# Altium schematic sheet Ethernet1.SchDoc
size A4; DocumentNumber: 20; SheetNumber: 20; SheetTotal: 47
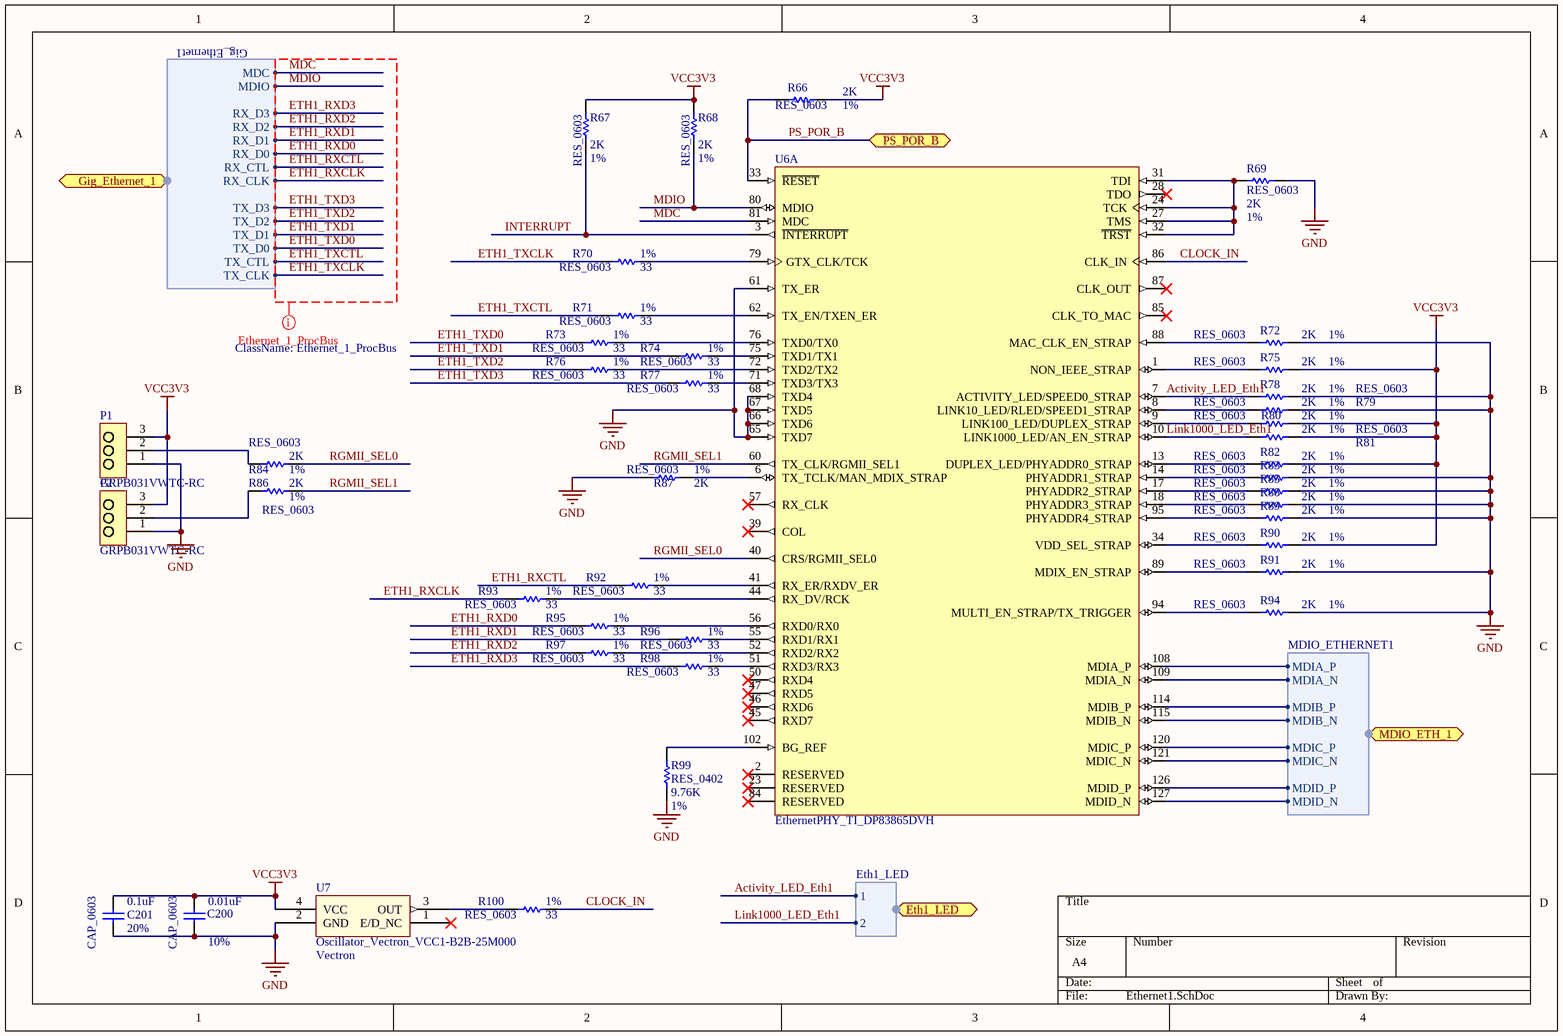
[diagram p0: Ethernet1.SchDoc]

## Parts
C200  CAP_0603  value 0.01uF  Tolerance: 10%  [CAPC0603(1608)100_N]
C201  CAP_0603  value 0.1uF  Tolerance: 20%  [CAPC0603(1608)100_N]
P1  GRPB031VWTC-RC  [Header_3-Pos_Sullins_GRPB031VWTC-RC]
P2  GRPB031VWTC-RC  [Header_3-Pos_Sullins_GRPB031VWTC-RC]
R66  RES_0603  value 2K  Tolerance: 1%  [RESC0603(1608)_N]
R67  RES_0603  value 2K  Tolerance: 1%  [RESC0603(1608)_N]
R68  RES_0603  value 2K  Tolerance: 1%  [RESC0603(1608)_N]
R69  RES_0603  value 2K  Tolerance: 1%  [RESC0603(1608)_N]
R70  RES_0603  value 33  Tolerance: 1%  [RESC0603(1608)_N]
R71  RES_0603  value 33  Tolerance: 1%  [RESC0603(1608)_N]
R72  RES_0603  value 2K  Tolerance: 1%  [RESC0603(1608)_N]
R73  RES_0603  value 33  Tolerance: 1%  [RESC0603(1608)_N]
R74  RES_0603  value 33  Tolerance: 1%  [RESC0603(1608)_N]
R75  RES_0603  value 2K  Tolerance: 1%  [RESC0603(1608)_N]
R76  RES_0603  value 33  Tolerance: 1%  [RESC0603(1608)_N]
R77  RES_0603  value 33  Tolerance: 1%  [RESC0603(1608)_N]
R78  RES_0603  value 2K  Tolerance: 1%  [RESC0603(1608)_N]
R79  RES_0603  value 2K  Tolerance: 1%  [RESC0603(1608)_N]
R80  RES_0603  value 2K  Tolerance: 1%  [RESC0603(1608)_N]
R81  RES_0603  value 2K  Tolerance: 1%  [RESC0603(1608)_N]
R82  RES_0603  value 2K  Tolerance: 1%  [RESC0603(1608)_N]
R83  RES_0603  value 2K  Tolerance: 1%  [RESC0603(1608)_N]
R84  RES_0603  value 2K  Tolerance: 1%  [RESC0603(1608)_N]
R85  RES_0603  value 2K  Tolerance: 1%  [RESC0603(1608)_N]
R86  RES_0603  value 2K  Tolerance: 1%  [RESC0603(1608)_N]
R87  RES_0603  value 2K  Tolerance: 1%  [RESC0603(1608)_N]
R88  RES_0603  value 2K  Tolerance: 1%  [RESC0603(1608)_N]
R89  RES_0603  value 2K  Tolerance: 1%  [RESC0603(1608)_N]
R90  RES_0603  value 2K  Tolerance: 1%  [RESC0603(1608)_N]
R91  RES_0603  value 2K  Tolerance: 1%  [RESC0603(1608)_N]
R92  RES_0603  value 33  Tolerance: 1%  [RESC0603(1608)_N]
R93  RES_0603  value 33  Tolerance: 1%  [RESC0603(1608)_N]
R94  RES_0603  value 2K  Tolerance: 1%  [RESC0603(1608)_N]
R95  RES_0603  value 33  Tolerance: 1%  [RESC0603(1608)_N]
R96  RES_0603  value 33  Tolerance: 1%  [RESC0603(1608)_N]
R97  RES_0603  value 33  Tolerance: 1%  [RESC0603(1608)_N]
R98  RES_0603  value 33  Tolerance: 1%  [RESC0603(1608)_N]
R99  RES_0402  value 9.76K  Tolerance: 1%  [RESC0402(1005)_N]
R100  RES_0603  value 33  Tolerance: 1%  [RESC0603(1608)_N]
U6  EthernetPHY_TI_DP83865DVH  [EthernetPHY_TI_DP83865(PQFP)_VLA128A_N]  (part A of 2)
U7  Oscillator_Vectron_VCC1-B2B-25M000  Manufacturer: Vectron  [Oscillator_Vectron_VCC1-B2B-25M000_SMD]

## Ports
Eth1_LED (harness Eth1_LED), Gig_Ethernet_1 (harness Gig_Ethernet1), MDIO_ETH_1 (harness MDIO_ETHERNET1), PS_POR_B (bidir)

## Harnesses
Gig_Ethernet1: TX_CLK, TX_CTL, TX_D0, TX_D1, TX_D2, TX_D3, RX_D0, RX_D1, RX_D2, RX_D3, RX_CLK, RX_CTL, MDIO, MDC
MDIO_ETHERNET1: MDIA_P, MDIA_N, MDIB_P, MDIB_N, MDIC_P, MDIC_N, MDID_P, MDID_N
Eth1_LED: 1, 2

## Nets
GND: C200.1 C201.2 P1.1 P2.1 R69.1 R72.1 R78.1 R79.1 R83.1 R85.1 R87.2 R88.1 R89.1 R91.1 R94.1 R99.1 U6.61(TX_ER) U6.65(TXD7) U6.66(TXD6) U6.67(TXD5) U6.68(TXD4) U7.2(GND)
VCC3V3: C200.2 C201.1 P1.3 P2.3 R66.1 R67.2 R68.2 R75.1 R80.1 R81.1 R82.1 R90.1 U7.4(VCC)
Activity_LED_Eth1: R78.2 U6.7(ACTIVITY_LED/SPEED0_STRAP) ; port Eth1_LED.1
CLOCK_IN: R100.2 U6.86(CLK_IN)
ETH1_RXCLK: R93.1 ; port Gig_Ethernet_1.RX_CLK
ETH1_RXCTL: R92.1 ; port Gig_Ethernet_1.RX_CTL
ETH1_RXD0: R95.1 ; port Gig_Ethernet_1.RX_D0
ETH1_RXD1: R96.1 ; port Gig_Ethernet_1.RX_D1
ETH1_RXD2: R97.1 ; port Gig_Ethernet_1.RX_D2
ETH1_RXD3: R98.1 ; port Gig_Ethernet_1.RX_D3
ETH1_TXCLK: R70.1 ; port Gig_Ethernet_1.TX_CLK
ETH1_TXCTL: R71.1 ; port Gig_Ethernet_1.TX_CTL
ETH1_TXD0: R73.1 ; port Gig_Ethernet_1.TX_D0
ETH1_TXD1: R74.1 ; port Gig_Ethernet_1.TX_D1
ETH1_TXD2: R76.1 ; port Gig_Ethernet_1.TX_D2
ETH1_TXD3: R77.1 ; port Gig_Ethernet_1.TX_D3
INTERRUPT: R67.1 U6.3(~{INTERRUPT})
Link1000_LED_Eth1: R81.2 U6.10(LINK1000_LED/AN_EN_STRAP) ; port Eth1_LED.2
MDC: U6.81(MDC) ; port Gig_Ethernet_1.MDC
MDIO: R68.1 U6.80(MDIO) ; port Gig_Ethernet_1.MDIO
PS_POR_B: R66.2 U6.33(~{RESET}) ; port PS_POR_B
RGMII_SEL0: R84.1 U6.40(CRS/RGMII_SEL0)
RGMII_SEL1: R86.1 U6.60(TX_CLK/RGMII_SEL1)
NetP1_2: P1.2 R84.2
NetP2_2: P2.2 R86.2
NetR69_2: R69.2 U6.24(TCK) U6.27(TMS) U6.31(TDI) U6.32(~{TRST})
NetR70_2: R70.2 U6.79(GTX_CLK/TCK)
NetR71_2: R71.2 U6.62(TX_EN/TXEN_ER)
NetR72_2: R72.2 U6.88(MAC_CLK_EN_STRAP)
NetR73_2: R73.2 U6.76(TXD0/TX0)
NetR74_2: R74.2 U6.75(TXD1/TX1)
NetR75_2: R75.2 U6.1(NON_IEEE_STRAP)
NetR76_2: R76.2 U6.72(TXD2/TX2)
NetR77_2: R77.2 U6.71(TXD3/TX3)
NetR79_2: R79.2 U6.8(LINK10_LED/RLED/SPEED1_STRAP)
NetR80_2: R80.2 U6.9(LINK100_LED/DUPLEX_STRAP)
NetR82_2: R82.2 U6.13(DUPLEX_LED/PHYADDR0_STRAP)
NetR83_2: R83.2 U6.14(PHYADDR1_STRAP)
NetR85_2: R85.2 U6.17(PHYADDR2_STRAP)
NetR87_1: R87.1 U6.6(TX_TCLK/MAN_MDIX_STRAP)
NetR88_2: R88.2 U6.18(PHYADDR3_STRAP)
NetR89_2: R89.2 U6.95(PHYADDR4_STRAP)
NetR90_2: R90.2 U6.34(VDD_SEL_STRAP)
NetR91_2: R91.2 U6.89(MDIX_EN_STRAP)
NetR92_2: R92.2 U6.41(RX_ER/RXDV_ER)
NetR93_2: R93.2 U6.44(RX_DV/RCK)
NetR94_2: R94.2 U6.94(MULTI_EN_STRAP/TX_TRIGGER)
NetR95_2: R95.2 U6.56(RXD0/RX0)
NetR96_2: R96.2 U6.55(RXD1/RX1)
NetR97_2: R97.2 U6.52(RXD2/RX2)
NetR98_2: R98.2 U6.51(RXD3/RX3)
NetR99_2: R99.2 U6.102(BG_REF)
NetR100_1: R100.1 U7.3(OUT)
NetU6_108: U6.108(MDIA_P) ; port MDIO_ETH_1.MDIA_P
NetU6_109: U6.109(MDIA_N) ; port MDIO_ETH_1.MDIA_N
NetU6_114: U6.114(MDIB_P) ; port MDIO_ETH_1.MDIB_P
NetU6_115: U6.115(MDIB_N) ; port MDIO_ETH_1.MDIB_N
NetU6_120: U6.120(MDIC_P) ; port MDIO_ETH_1.MDIC_P
NetU6_121: U6.121(MDIC_N) ; port MDIO_ETH_1.MDIC_N
NetU6_126: U6.126(MDID_P) ; port MDIO_ETH_1.MDID_P
NetU6_127: U6.127(MDID_N) ; port MDIO_ETH_1.MDID_N

Not connected (* = marked no-connect by the designer): U6 2(RESERVED)* 23(RESERVED)* 28(TDO)* 39(COL)* 45(RXD7)* 46(RXD6)* 47(RXD5)* 50(RXD4)* 57(RX_CLK)* 84(RESERVED)* 85(CLK_TO_MAC)* 87(CLK_OUT)*; U7 1(E/D_NC)*

## Layout directives
net class Ethernet_1_ProcBus: ETH1_RXCLK, ETH1_RXCTL, ETH1_RXD0, ETH1_RXD1, ETH1_RXD2, ETH1_RXD3, ETH1_TXCLK, ETH1_TXCTL, ETH1_TXD0, ETH1_TXD1, ETH1_TXD2, ETH1_TXD3, MDC, MDIO

## Library data of the parts
C200 = C0603C103K9RACTU: CAP CER 10000PF 6.3V X7R 0603; Manufacturer: Kemet; Part Number: C0603C103K9RACTU; Footprint Ref: CAPC0603(1608)100_N; Library Ref: CAP_0603
C201 = 6R3X14W104MV4T: CAP CER 0.1UF 6.3V 20% X7R 0603; Manufacturer: Johanson Dielectrics Inc; Part Number: 6R3X14W104MV4T; Footprint Ref: CAPC0603(1608)100_N; Library Ref: CAP_0603
P1 P2 = GRPB031VWTC-RC: CONN HEADER .050" 3POS SMD GOLD; Manufacturer: Sullins Connector Solutions; Part Number: GRPB031VWTC-RC
R66-R69 R72 R75 R78-R91 R94 = ERJ-3EKF2001V: RES 2.00K OHM 1/10W 1% 0603 SMD; Manufacturer: Panasonic Electronics Components; Part Number: ERJ-3EKF2001V; Footprint Ref: RESC0603(1608)_N; Library Ref: RES_0603
R70 R71 R73 R74 R76 R77 R92 R93 R95-R98 R100 = ERJ-3EKF33R0V: RES 33.0 OHM 1/10W 1% 0603 SMD; Manufacturer: Panasonic Electronics Components; Part Number: ERJ-3EKF33R0V; Footprint Ref: RESC0603(1608)_N; Library Ref: RES_0603
R99 = CRCW04029K76FKED: 9.76K ohm, 1% 1/16W, 0402; Manufacturer: Vishay/Dale; Part Number: CRCW04029K76FKED; Footprint Ref: RESC0402(1005)_N; Library Ref: RES_0402
U6 = DP83865DVH: Ethernet PHY_TI_DP83865DVH, Gigabit Ethernet PHYTER,128 Lead Plastic Flat Pack; Manufacturer: Texas Instruments; Part Number: DP83865DVH
U7 = VCC1-B2B-25M000: VCC1-B2B-25M000, 25MHz, 3.3V +/- 10%, No tri-state, +/-50 ppm, -40 to +85 deg; Part Number: VCC1-B2B-25M000; Footprint Ref: Oscillator_Vectron_VCC1-B2B-25M000_SMD; Library Ref: Oscillator_Vectron_VCC1-B2B-25M000